# EAGLE design Steering Wheel Raspberry Pi rev2 (EAGLE 8.3.1)
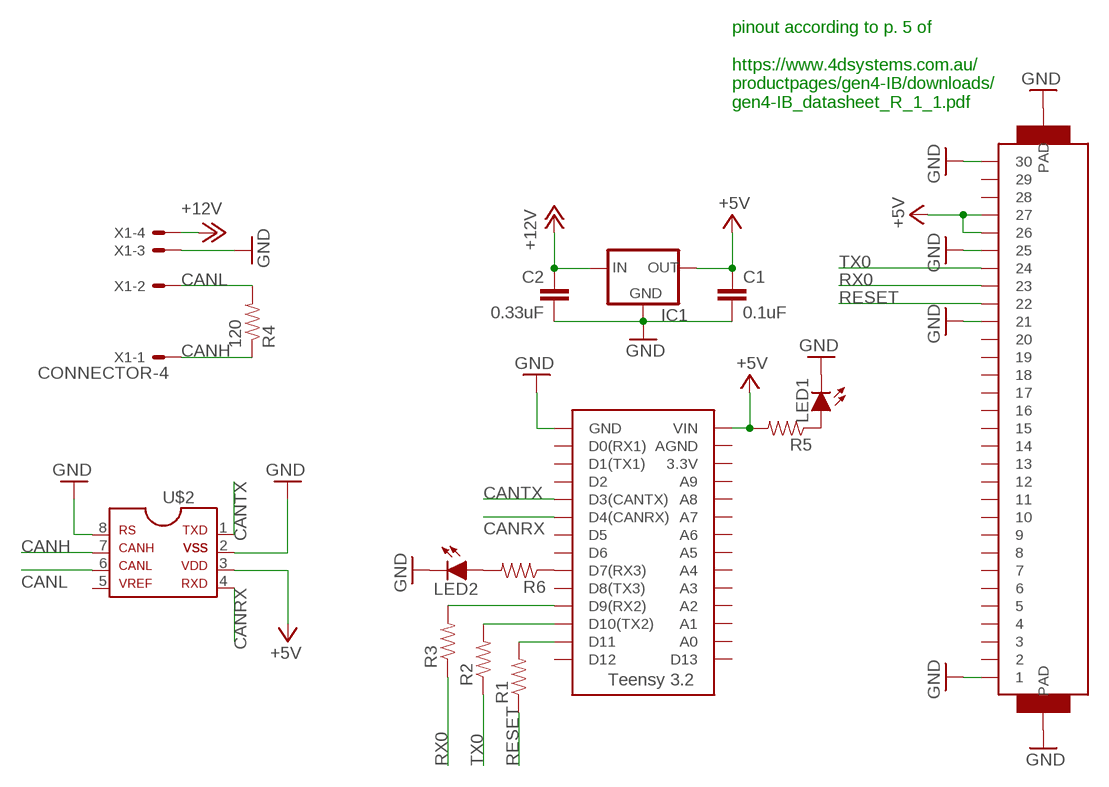
[diagram p0: schematic, sheet 1]

## Parts
C1  0.1uF  CAP0805  [0805]
C2  0.33uF  CAP0805  [0805]
IC1  5VREG_L7805_VERT  [TO-220]
LED1  LED-0805  [LED-805]
LED2  LED-0805  [LED-805]
R1  RESISTOR0805-RES  [0805]
R2  RESISTOR0805-RES  [0805]
R3  RESISTOR0805-RES  [0805]
R4  120  RESISTOR0805-RES  [0805]
R5  RESISTOR0805-RES  [0805]
R6  RESISTOR0805-RES  [0805]
U$1  TEENSY_3.2_SIMPLE  [TEENSY_3.2_SIMPLE]
U$2  MCP2551  [SOIC-08]
U$3  FFC-30P-0.5MM  [FFC-30P-0.5MM]
X1  CONNECTOR-4  [MINIFIT_5566-4]

## Nets
+5V: C1.1 IC1.3(OUT) R5.2 U$1.VIN U$2.3 U$3.26 U$3.27
+12V: C2.1 IC1.1(IN) X1.4
CANH: R4.1 U$2.7 X1.1
CANL: R4.2 U$2.6 X1.2
CANRX: U$1.D4(CANRX) U$2.4
CANTX: U$1.D3(CANTX) U$2.1
GND: C1.2 C2.2 IC1.2(GND) LED1.C LED2.C U$1.GND U$2.2 U$2.8 U$3.1 U$3.21 U$3.25 U$3.30 U$3.PAD@0(PAD) U$3.PAD@1(PAD) X1.3
N$1: LED1.A R5.1
N$2: R6.1 U$1.D7(RX3)
N$3: LED2.A R6.2
RESET: R1.1 U$3.22
RX0: R3.1 U$3.23
TX0: R2.1 U$3.24
UC_RST: R1.2 U$1.D11
UC_RX: R3.2 U$1.D9(RX2)
UC_TX: R2.2 U$1.D10(TX2)
Unconnected: U$1.3.3V U$1.A0 U$1.A1 U$1.A2 U$1.A3 U$1.A4 U$1.A5 U$1.A6 U$1.A7 U$1.A8 U$1.A9 U$1.AGND U$1.D0(RX1) U$1.D1(TX1) U$1.D2 U$1.D5 U$1.D6 U$1.D8(TX3) U$1.D12 U$1.D13 U$2.5 U$3.2 U$3.3 U$3.4 U$3.5 U$3.6 U$3.7 U$3.8 U$3.9 U$3.10 U$3.11 U$3.12 U$3.13 U$3.14 U$3.15 U$3.16 U$3.17 U$3.18 U$3.19 U$3.20 U$3.28 U$3.29

## Notes on the sheet
- pinout according to p. 5 of
  
  https://www.4dsystems.com.au/
  productpages/gen4-IB/downloads/
  gen4-IB_datasheet_R_1_1.pdf

## Library data of the parts
C1 C2 = HyTechDevices:CAP: Capacitor Standard 0603 ceramic capacitor, and 0.1" leaded capacitor.
IC1 = HyTechDevices:5VREG_L7805: Voltage Regulator Switching 5v regulator Datasheet <http://power.murata.com/data/power/oki-78sr.pdf> Standard 7805 5V regulator. IGO (Input Ground Output). Spark Fun Electronics SKU : COM-00107 Datasheet <http://www.mouser.com/ds/2/308/MC7800-D-94905.pdf>
LED1 LED2 = HyTechDevices:LED: Light Emitting Diode (LED) Source: Dangerous Prototypes Eagle Library <https://github.com/DangerousPrototypes/Eagle_Part_Library>
R1-R6 = HyTechDevices:RESISTOR: Resistor Basic schematic elements and footprints for 0603, 1206, and PTH resistors.
U$1 = HyTechDevices:TEENSY_3.2_SIMPLE: Simple version of the Teensy 3.2 board that only uses the 2 main rows of pins, not the inner pins or the pins opposite the usb port.
U$2 = HyTechDevices:MCP2551: MCP2551 High-Speed CAN Transceiver Product Webpage <https://www.microchip.com/wwwproducts/en/MCP2551> Datasheet <http://ww1.microchip.com/downloads/en/DeviceDoc/21667f.pdf> This device is outdated It is replaced by MCP2561. Comparison Page <https://www.microchip.com/wwwproducts/ProductCompare/MCP2551/MCP2561> Product Webpage <https://www.microchip.com/wwwproducts/en/MCP2561> Datasheet <http://ww1.microchip.com/downloads/en/DeviceDoc/20005167C.pdf>
U$3 = HyTechDevices:FFC-30P-0.5MM
X1 = HyTechDevices:CONNECTOR-4: Mini-Fit Junior connector 4 pole Source: http://www.molex.com; OC_FARNELL: unknown; OC_NEWARK: unknown

## Board
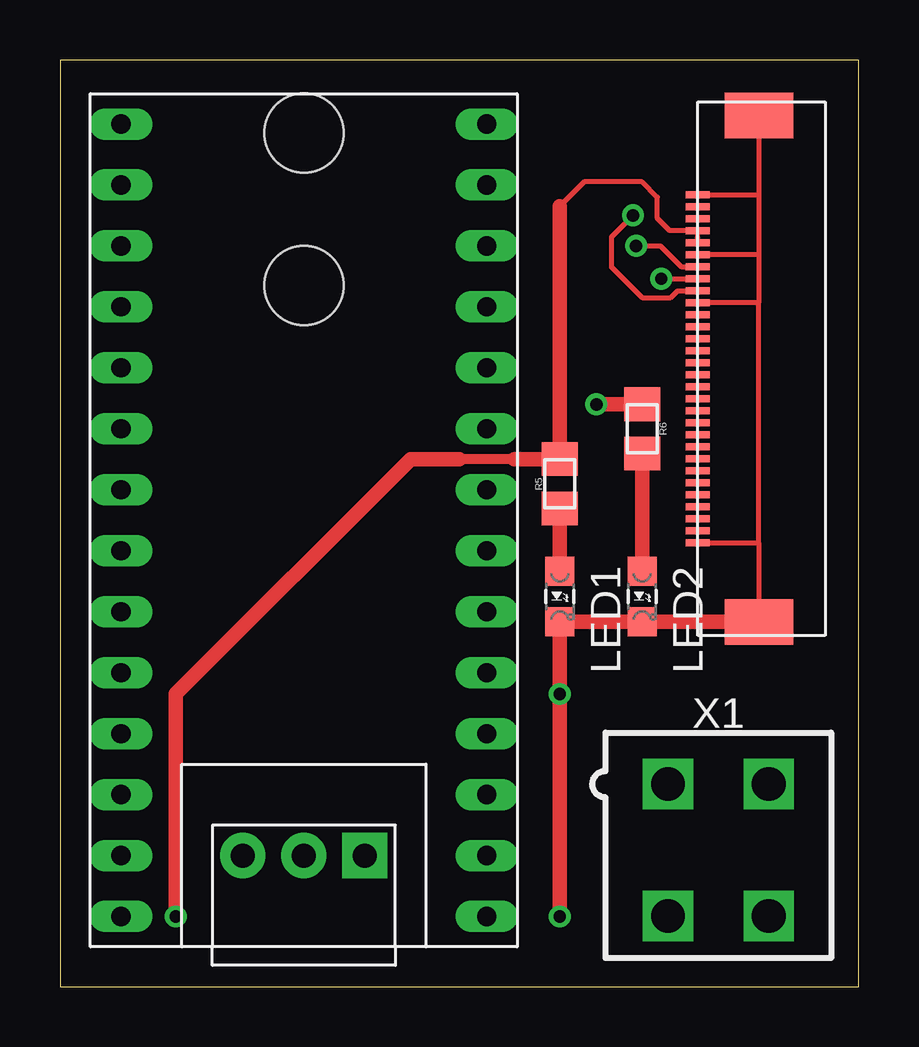
[diagram p1: board, top side]
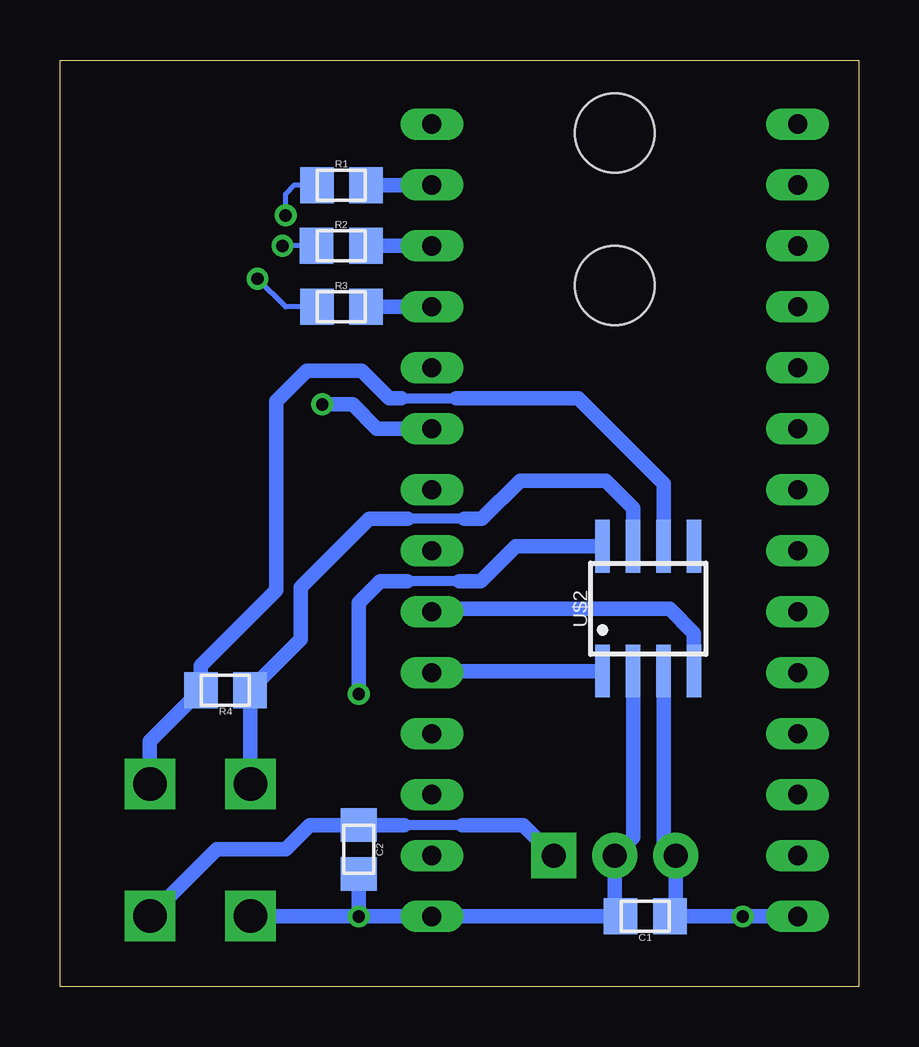
[diagram p2: board, bottom side, seen from below]

Size 33.27 x 38.61 mm. Coordinates in mm from the lower left corner, seen from the top.
Outline: 0,0 33.27,0 33.27,38.61 0,38.61 0,0
Copper layers (1*16): Top 0.035mm / dielectric 1.5mm / Bottom 0.035mm
Design rules "DRC Advanced Circuits": minimum track width 6mil, minimum drill 15mil, track to track 6mil, track to pad 6mil, pad to pad 6mil, via to via 6mil, smd to smd 6mil, copper to edge 40mil, drill to drill 6mil, minimum pad ring 10mil, minimum via ring 8mil, stop-mask expansion 4mil, vias tented up to drill 0mil, thermal gap 10mil
Holes 3.3 mm at 10.16,35.56 10.16,29.21

### Footprints (pad centres in the part's own frame; a part is rotated, then mirrored left to right if it is on the bottom)
0805 = smd 1.4 x 1.5: 1 -1.025,0; 2 1.025,0
TO-220 = drill 1 pad 1.88 square: 1 -2.54,0 | drill 1 pad 1.88: 2 0,0; 3 2.54,0
LED-805 = smd 1.2 x 1.2: A 0,-1.05; C 0,1.05
TEENSY_3.2_SIMPLE = drill 0.8 long: 3.3V 16.51,29.21; A0 16.51,3.81; A1 16.51,6.35; A2 16.51,8.89; A3 16.51,11.43; A4 16.51,13.97; A5 16.51,16.51; A6 16.51,19.05; A7 16.51,21.59; A8 16.51,24.13; A9 16.51,26.67; AGND 16.51,31.75; D0(RX1) 1.27,31.75; D1(TX1) 1.27,29.21; D2 1.27,26.67; D3(CANTX) 1.27,24.13; D4(CANRX) 1.27,21.59; D5 1.27,19.05; D6 1.27,16.51; D7(RX3) 1.27,13.97; D8(TX3) 1.27,11.43; D9(RX2) 1.27,8.89; D10(TX2) 1.27,6.35; D11 1.27,3.81; D12 1.27,1.27; D13 16.51,1.27; GND 1.27,34.29; VIN 16.51,34.29
SOIC-08 = smd 0.6 x 2.2: 1 -1.905,-2.6; 2 -0.635,-2.6; 3 0.635,-2.6; 4 1.905,-2.6; 5 1.905,2.6; 6 0.635,2.6; 7 -0.635,2.6; 8 -1.905,2.6
FFC-30P-0.5MM = smd 1 x 0.284: 1 0,7.5; 2 0,7; 3 0,6.5; 4 0,6; 5 0,5.5; 6 0,5; 7 0,4.5; 8 0,4; 9 0,3.5; 10 0,3; 11 0,2.5; 12 0,2; 13 0,1.5; 14 0,1; 15 0,0.5; 16 0,0; 17 0,-0.5; 18 0,-1; 19 0,-1.5; 20 0,-2; 21 0,-2.5; 22 0,-3; 23 0,-3.5; 24 0,-4; 25 0,-4.5; 26 0,-5; 27 0,-5.5; 28 0,-6; 29 0,-6.5; 30 0,-7 | smd 2.85 x 1.905: PAD@0 -2.54,-10.302; PAD@1 -2.54,10.802
MINIFIT_5566-4 = drill 1.4 square: 1 2.1,-2.75; 2 -2.1,-2.75; 3 2.1,2.75; 4 -2.1,2.75

### Placement (x,y rotation side)
C1  8.89,2.92 180 bottom
C2  20.83,5.71 270 bottom
IC1  10.16,5.46 180 top
LED1  20.83,16.26 180 top
LED2  24.26,16.26 180 top
R1  21.55,33.4 0 bottom
R2  21.55,30.87 0 bottom
R3  21.55,28.32 0 bottom
R4  26.38,12.34 180 bottom
R5  20.83,20.95 90 top
R6  24.26,23.24 270 top
U$1  19.05,37.21 180 top
U$2  8.76,15.75 0 bottom
U$3  26.58,26 180 top
X1  27.43,5.68 180 top

### Tracks (layer width: path | path; a pad name or v marks a point on that pad's centre or on a via)
+5V  (via drill 0.51)
  Top 0.203: U$3.26 U$3.27 25.4,31.5 24.89,32 24.89,32.89 24.26,33.53 21.84,33.53 20.83,32.51
  Top 0.406: 18.92,21.97 16.64,21.97
  Top 0.61: 18.92,21.97 18.93,21.98 R5.2 20.83,32.51 | 16.64,21.97 14.61,21.97 4.83,12.19 v4.83,2.92
  Bottom 0.61: U$2.3 8.13,5.97 IC1.3 7.62,3.17 C1.1 v4.83,2.92 U$1.VIN
+12V
  Bottom 0.406: 16.51,6.73 18.92,6.73
  Bottom 0.61: IC1.1 13.97,6.73 16.51,6.73 | 18.92,6.73 20.69,6.73 arc90 C2.1 22.86,6.73 23.88,5.71 26.75,5.71 X1.4
CANH
  Bottom 0.406: 16.43,19.48 16.44,19.49 18.8,19.49
  Bottom 0.61: X1.1 25.35,8.46 R4.1 25.35,12.37 23.24,14.48 23.24,16.64 20.39,19.49 18.8,19.49 | U$2.7 9.4,19.94 10.54,21.08 14.1,21.08 15.7,19.48 16.43,19.48
CANL
  Bottom 0.406: 19.05,24.51 16.76,24.51
  Bottom 0.61: X1.2 29.53,10.21 R4.2 27.4,13.36 24.26,16.51 24.26,24.38 22.99,25.65 20.7,25.65 19.56,24.51 19.05,24.51 | 16.76,24.51 11.68,24.51 8.13,20.95 U$2.6
CANRX
  Bottom 0.61: U$2.4 6.86,14.73 7.87,15.75 17.65,15.75 U$1.D4(CANRX)
CANTX
  Bottom 0.61: U$2.1 17.71,13.15 U$1.D3(CANTX)
GND  (via drill 0.51)
  Top 0.203: U$3.1 29.11,18.5 | 29.11,18.5 U$3.PAD@1 | 29.11,18.5 29.11,28.5 | 29.11,28.5 U$3.21 | 29.11,30.5 29.11,28.5 | 29.11,30.5 U$3.25 | U$3.30 29.11,33 | 29.11,33 29.11,32.99 29.11,30.5 | U$3.PAD@0 29.11,33
  Top 0.61: v20.83,2.92 v20.83,12.19 LED1.C LED2.C 26.96,15.21 | 26.96,15.21 26.97,15.2 | 26.96,15.21 U$3.PAD@1
  Bottom 0.406: 16.64,16.89 18.8,16.89
  Bottom 0.61: U$2.2 9.4,6.22 IC1.2 10.16,3.17 C1.2 U$1.GND v20.83,2.92 | C2.2 v20.83,2.92 | v20.83,2.92 X1.3 arc90 X1.3 | U$2.8 14.29,18.35 15.75,16.89 16.64,16.89 | 18.8,16.89 19.94,16.89 20.83,16 v20.83,12.19
N$1
  Top 0.61: R5.1 LED1.A
N$2  (via drill 0.51)
  Top 0.61: v22.35,24.26 24.25,24.26 R6.1
  Bottom 0.61: U$1.D7(RX3) 20.07,23.24 21.08,24.26 v22.35,24.26
N$3
  Top 0.61: R6.2 LED2.A
RESET  (via drill 0.51)
  Top 0.203: U$3.22 25.74,28.99 25.45,28.7 24.26,28.7 22.99,29.97 22.99,31.24 v23.88,32.13
  Bottom 0.203: v23.88,32.13 23.88,33.02 23.5,33.4 R1.1
RX0  (via drill 0.51)
  Top 0.203: v25.05,29.49 U$3.23
  Bottom 0.203: R3.1 23.88,28.32 v25.05,29.49
TX0  (via drill 0.51)
  Top 0.203: v24,30.86 25.02,30.86 25.88,30 U$3.24
  Bottom 0.203: R2.1 v24,30.87 v24,30.86
UC_RST
  Bottom 0.61: R1.2 U$1.D11
UC_RX
  Bottom 0.61: R3.2 U$1.D9(RX2)
UC_TX
  Bottom 0.61: R2.2 U$1.D10(TX2)